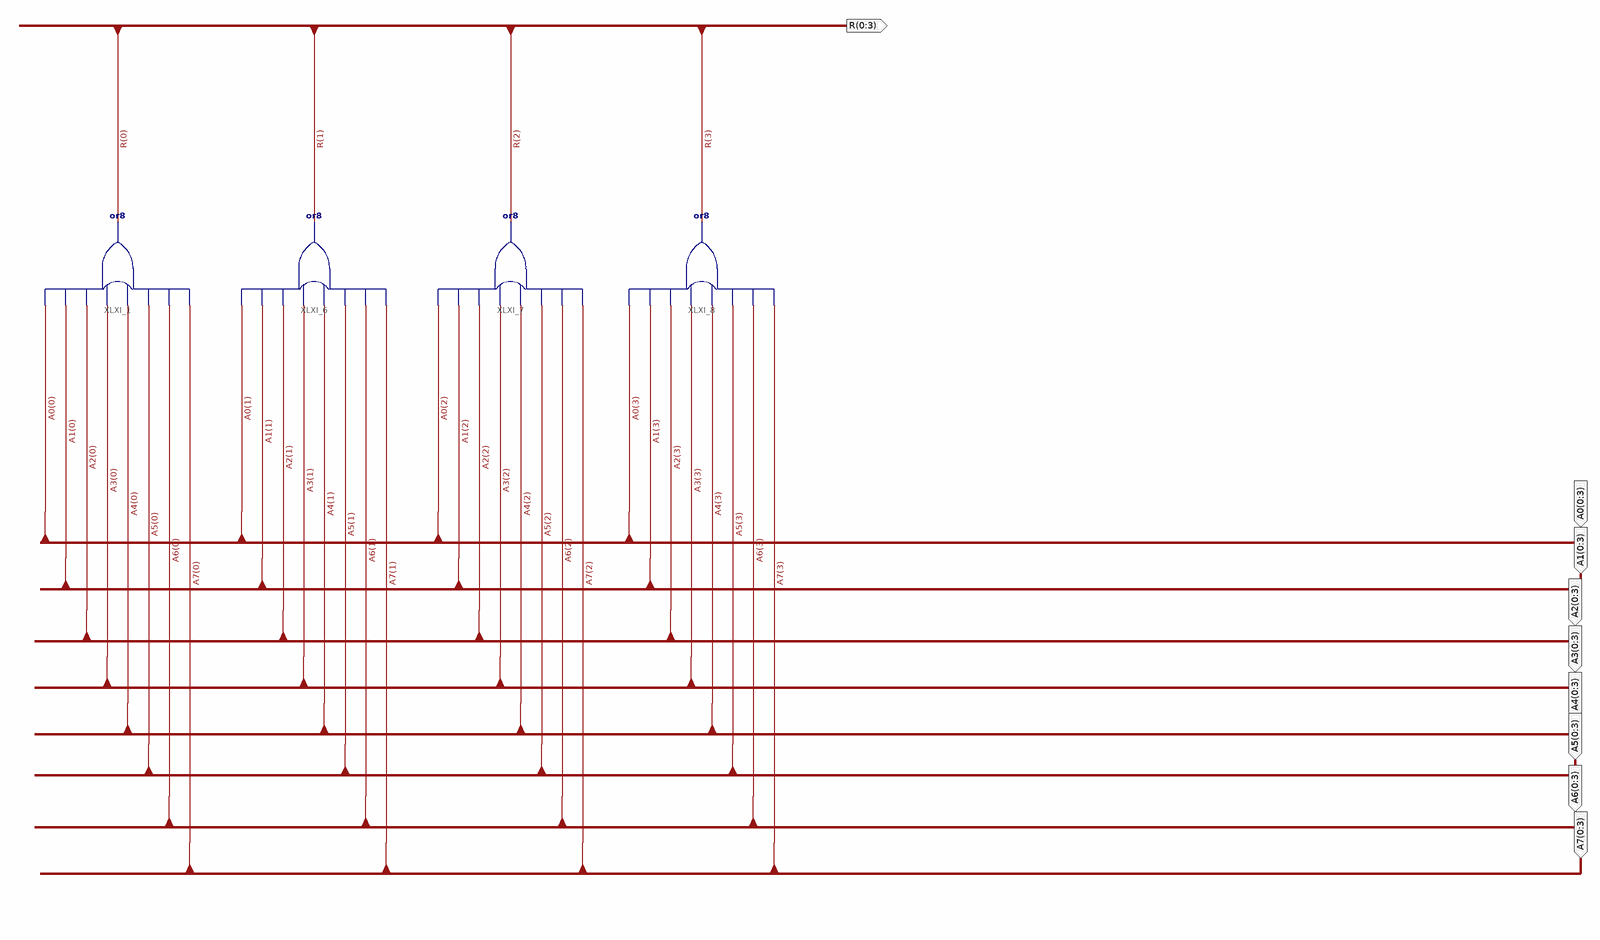
[diagram p0: schematic sheet 1]
// Xilinx ISE schematic BUS4OR8.sch (spartan3e) as structural Verilog: 4 symbols, 9 ports
module BUS4OR8 (
  input  [0:3] A1,
  input  [0:3] A2,
  input  [0:3] A3,
  input  [0:3] A4,
  input  [0:3] A0,
  input  [0:3] A5,
  input  [0:3] A6,
  input  [0:3] A7,
  output [0:3] R
);

  or XLXI_8 (R[3], A7[3], A6[3], A5[3], A4[3], A3[3], A2[3], A1[3], A0[3]);
  or XLXI_7 (R[2], A7[2], A6[2], A5[2], A4[2], A3[2], A2[2], A1[2], A0[2]);
  or XLXI_6 (R[1], A7[1], A6[1], A5[1], A4[1], A3[1], A2[1], A1[1], A0[1]);
  or XLXI_1 (R[0], A7[0], A6[0], A5[0], A4[0], A3[0], A2[0], A1[0], A0[0]);
endmodule
